# EAGLE design CanRelay (EAGLE 7.7.0)
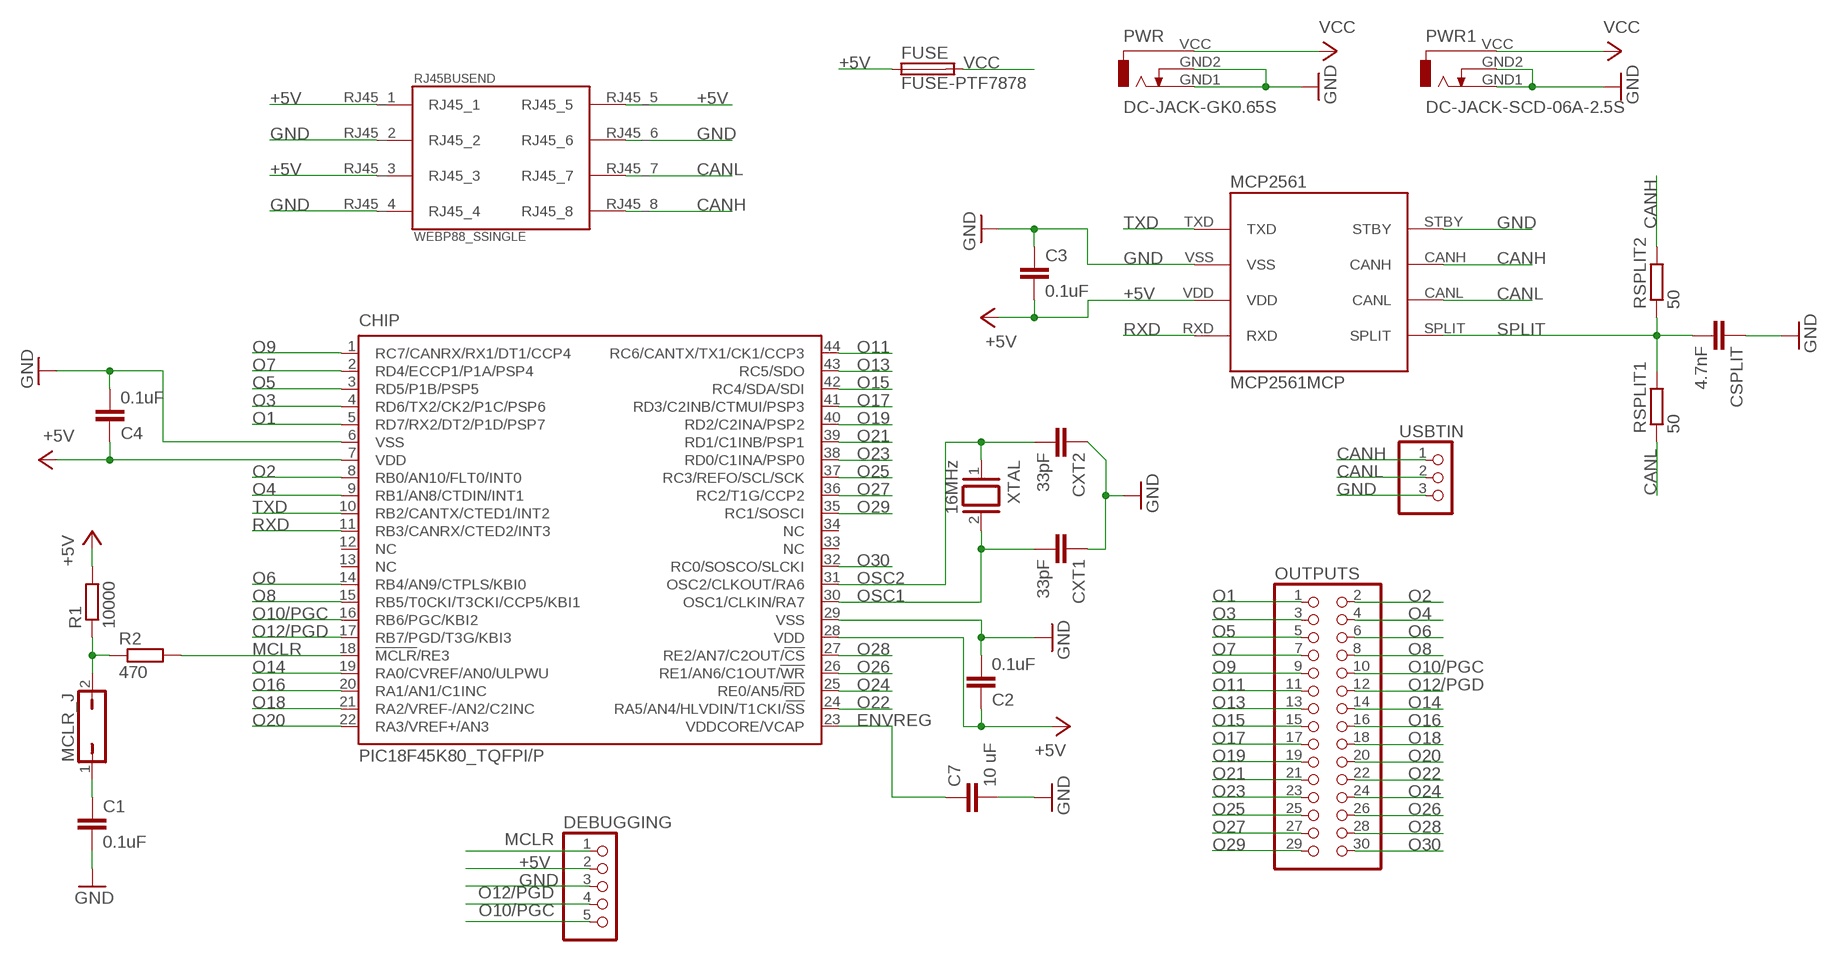
[diagram p0: schematic, sheet 1]

## Parts
C1  0.1uF  C-EU050-025X075  [C050-025X075]
C2  0.1uF  C-EU050-025X075  [C050-025X075]
C3  0.1uF  C-EU050-025X075  [C050-025X075]
C4  0.1uF  C-EU050-025X075  [C050-025X075]
C7  10 uF  C-EU050-025X075  [C050-025X075]
CHIP  PIC18F45K80_TQFPI/P  [TQFP44]
CSPLIT  4.7nF  C-EU050-025X075  [C050-025X075]
CXT1  33pF  C-EU025-030X050  [C025-030X050]
CXT2  33pF  C-EU025-030X050  [C025-030X050]
DEBUGGING  PINHD-1X5  [1X05]
FUSE  FUSE-PTF7878  [FUSE-PTF78]
MCLR_J  JP1Q  [JP1]
MCP2561  MCP2561MCP  [MCP2561_PDIP]
OUTPUTS  PINHD-2X15  [2X15]
PWR  DC-JACK-GK0.65S  [DC-JACK-GK0.65]
PWR1  DC-JACK-SCD-06A-2.5S  [DC-JACK-SCD-016A-2.5]
R1  10000  R-EU_0207/10  [0207/10]
R2  470  R-EU_0207/10  [0207/10]
RJ45BUSEND  WEBP88_SSINGLE  [WEBP88_RJ45_SINGLE]
RSPLIT1  50  R-EU_0207/10  [0207/10]
RSPLIT2  50  R-EU_0207/10  [0207/10]
USBTIN  PINHD-1X3  [1X03]
XTAL  16MHz  XTAL/S  [QS]

## Nets
+5V: C2.1 C3.2 C4.1 CHIP.7(VDD) CHIP.28(VDD) DEBUGGING.2 FUSE.P1 MCP2561.VDD R1.2 RJ45BUSEND.RJ45_1 RJ45BUSEND.RJ45_3 RJ45BUSEND.RJ45_5
CANH: MCP2561.CANH RJ45BUSEND.RJ45_8 RSPLIT2.2 USBTIN.1
CANL: MCP2561.CANL RJ45BUSEND.RJ45_7 RSPLIT1.1 USBTIN.2
ENVREG: C7.1 CHIP.23(VDDCORE/VCAP)
GND: C1.2 C2.2 C3.1 C4.2 C7.2 CHIP.6(VSS) CHIP.29(VSS) CSPLIT.1 CXT1.1 CXT2.1 DEBUGGING.3 MCP2561.STBY MCP2561.VSS PWR1.GND1 PWR1.GND2 PWR.GND1 PWR.GND2 RJ45BUSEND.RJ45_2 RJ45BUSEND.RJ45_4 RJ45BUSEND.RJ45_6 USBTIN.3
MCLR: CHIP.18(!MCLR!/RE3) DEBUGGING.1 R2.2
N$1: C1.1 MCLR_J.1
N$2: MCLR_J.2 R1.1 R2.1
O1: CHIP.5(RD7/RX2/DT2/P1D/PSP7) OUTPUTS.1
O2: CHIP.8(RB0/AN10/FLT0/INT0) OUTPUTS.2
O3: CHIP.4(RD6/TX2/CK2/P1C/PSP6) OUTPUTS.3
O4: CHIP.9(RB1/AN8/CTDIN/INT1) OUTPUTS.4
O5: CHIP.3(RD5/P1B/PSP5) OUTPUTS.5
O6: CHIP.14(RB4/AN9/CTPLS/KBI0) OUTPUTS.6
O7: CHIP.2(RD4/ECCP1/P1A/PSP4) OUTPUTS.7
O8: CHIP.15(RB5/T0CKI/T3CKI/CCP5/KBI1) OUTPUTS.8
O9: CHIP.1(RC7/CANRX/RX1/DT1/CCP4) OUTPUTS.9
O10/PGC: CHIP.16(RB6/PGC/KBI2) DEBUGGING.5 OUTPUTS.10
O11: CHIP.44(RC6/CANTX/TX1/CK1/CCP3) OUTPUTS.11
O12/PGD: CHIP.17(RB7/PGD/T3G/KBI3) DEBUGGING.4 OUTPUTS.12
O13: CHIP.43(RC5/SDO) OUTPUTS.13
O14: CHIP.19(RA0/CVREF/AN0/ULPWU) OUTPUTS.14
O15: CHIP.42(RC4/SDA/SDI) OUTPUTS.15
O16: CHIP.20(RA1/AN1/C1INC) OUTPUTS.16
O17: CHIP.41(RD3/C2INB/CTMUI/PSP3) OUTPUTS.17
O18: CHIP.21(RA2/VREF-/AN2/C2INC) OUTPUTS.18
O19: CHIP.40(RD2/C2INA/PSP2) OUTPUTS.19
O20: CHIP.22(RA3/VREF+/AN3) OUTPUTS.20
O21: CHIP.39(RD1/C1INB/PSP1) OUTPUTS.21
O22: CHIP.24(RA5/AN4/HLVDIN/T1CKI/!SS!) OUTPUTS.22
O23: CHIP.38(RD0/C1INA/PSP0) OUTPUTS.23
O24: CHIP.25(RE0/AN5/!RD!) OUTPUTS.24
O25: CHIP.37(RC3/REFO/SCL/SCK) OUTPUTS.25
O26: CHIP.26(RE1/AN6/C1OUT/!WR!) OUTPUTS.26
O27: CHIP.36(RC2/T1G/CCP2) OUTPUTS.27
O28: CHIP.27(RE2/AN7/C2OUT/!CS!) OUTPUTS.28
O29: CHIP.35(RC1/SOSCI) OUTPUTS.29
O30: CHIP.32(RC0/SOSCO/SLCKI) OUTPUTS.30
OSC1: CHIP.30(OSC1/CLKIN/RA7) CXT1.2 XTAL.2
OSC2: CHIP.31(OSC2/CLKOUT/RA6) CXT2.2 XTAL.1
RXD: CHIP.11(RB3/CANRX/CTED2/INT3) MCP2561.RXD
SPLIT: CSPLIT.2 MCP2561.SPLIT RSPLIT1.2 RSPLIT2.1
TXD: CHIP.10(RB2/CANTX/CTED1/INT2) MCP2561.TXD
VCC: FUSE.P2 PWR1.VCC PWR.VCC
Unconnected: CHIP.12(NC) CHIP.13(NC) CHIP.33(NC) CHIP.34(NC)

## Library data of the parts
C1-C4 C7 CSPLIT CXT1 CXT2 = rcl:C-EU: CAPACITOR, European symbol
CHIP = PoJD:PIC18F45K80_TQFP: PIC18F4*K80. TQFP44 variant.
DEBUGGING = pinhead:PINHD-1X5: PIN HEADER
FUSE = PoJD:FUSE-PTF78: Pojistkové pouzdro do DPS pro pojistky 5x20mm. Otevírání pomocí šroubováku. Nastojato. Rozteč vývodů: 22,6mm Jmenovité napětí: 250V AC Jmenovitý proud: 6,3A Součástí dodávky je kryt. https://www.gme.cz/pojistkove-pouzdro-do-dps-ks-ptf78-bs232
MCLR_J = jumper:JP1Q: JUMPER
MCP2561 = PoJD:MCP2561: High-Speed CAN Transceiver See http://ww1.microchip.com/downloads/en/DeviceDoc/25167A.pdf The MCP2561/2 is a Microchip Technology Inc. second generation high-speed CAN transceiver. It serves as an interface between a CAN protocol controller and the physical two-wire CAN bus. The device meets the automotive requirements for high-speed (up to 1 Mb/s), low quiescent current, electromagnetic compatibility (EMC) and electrostatic discharge (ESD).
OUTPUTS = pinhead:PINHD-2X15: PIN HEADER
PWR = PoJD:DC-JACK-GK0.65: Napájecí souosý konektor PC-GK0.65. https://www.gme.cz/napajeci-souosy-konektor-pc-gk0-65
PWR1 = PoJD:DC-JACK-SCD-06A-2.5: Napájecí souosý konektor do DPS 2,5mm vidlice. https://www.gme.cz/napajeci-souosy-konektor-scd-016a.
R1 R2 RSPLIT1 RSPLIT2 = rcl:R-EU_: RESISTOR, European symbol
RJ45BUSEND = PoJD:WEBP88_S: RJ45 konektor do DPS, 8/8 pinů. https://www.gme.cz/rj-konektor-webp-8-8-pcb
USBTIN = pinhead:PINHD-1X3: PIN HEADER
XTAL = special:XTAL/S: CRYSTAL

## Board
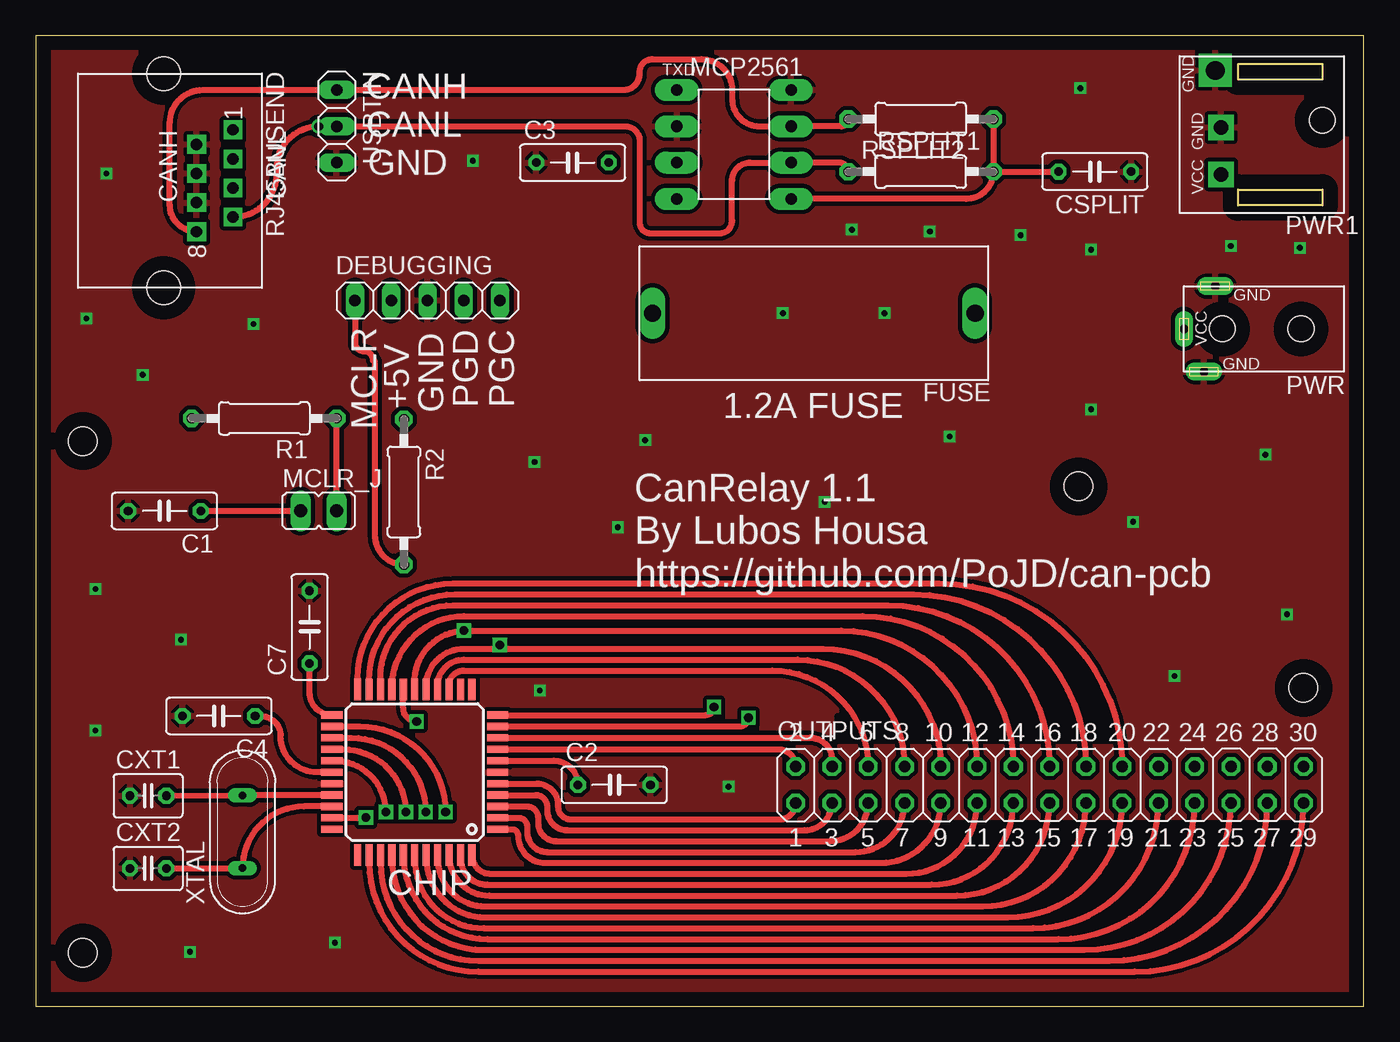
[diagram p1: board, top side]
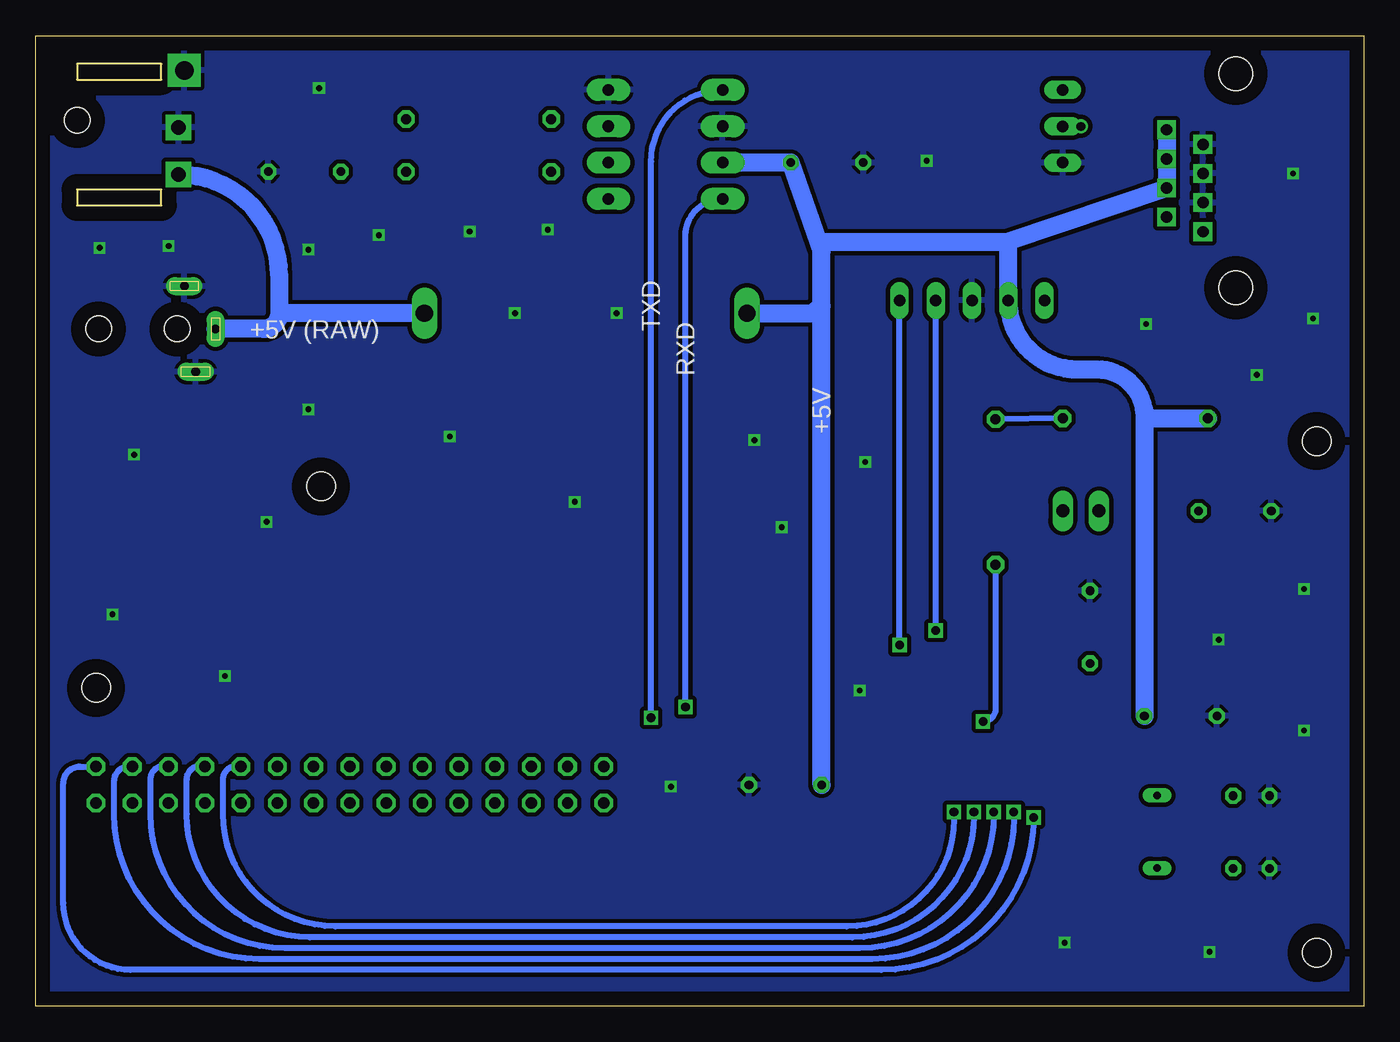
[diagram p2: board, bottom side, seen from below]

Size 93 x 67.94 mm. Coordinates in mm from the lower left corner, seen from the top.
Outline: 0,0 93,0 93,67.94 0,67.94 0,0
Copper layers (1*16): Top 0.035mm / dielectric 1.5mm / Bottom 0.035mm
Design rules "default *": minimum track width 0.015240625mm, minimum drill 0.3mm, track to track 8mil, track to pad 8mil, pad to pad 8mil, via to via 8mil, smd to smd 8mil, copper to edge 40mil, drill to drill 8mil, minimum pad ring 10mil, minimum via ring 8mil, stop-mask expansion 8mil, vias tented up to drill 0.6mm, thermal gap 10mil
Holes 2 mm at 3.3,39.56 88.77,22.28 3.3,3.74 73.03,36.38

### Footprints (pad centres in the part's own frame; a part is rotated, then mirrored left to right if it is on the bottom)
C050-025X075 = drill 0.6 octagon: 1 -2.54,0; 2 2.54,0
TQFP44 = smd 1.5 x 0.5: 1 -5.8,4; 2 -5.8,3.2; 3 -5.8,2.4; 4 -5.8,1.6; 5 -5.8,0.8; 6 -5.8,0; 7 -5.8,-0.8; 8 -5.8,-1.6; 9 -5.8,-2.4; 10 -5.8,-3.2; 11 -5.8,-4; 23 5.8,-4; 24 5.8,-3.2; 25 5.8,-2.4; 26 5.8,-1.6; 27 5.8,-0.8; 28 5.8,0; 29 5.8,0.8; 30 5.8,1.6; 31 5.8,2.4; 32 5.8,3.2; 33 5.8,4 | smd 0.5 x 1.5: 12 -4,-5.8; 13 -3.2,-5.8; 14 -2.4,-5.8; 15 -1.6,-5.8; 16 -0.8,-5.8; 17 0,-5.8; 18 0.8,-5.8; 19 1.6,-5.8; 20 2.4,-5.8; 21 3.2,-5.8; 22 4,-5.8; 34 4,5.8; 35 3.2,5.8; 36 2.4,5.8; 37 1.6,5.8; 38 0.8,5.8; 39 0,5.8; 40 -0.8,5.8; 41 -1.6,5.8; 42 -2.4,5.8; 43 -3.2,5.8; 44 -4,5.8
C025-030X050 = drill 0.6 octagon: 1 -1.27,0; 2 1.27,0
1X05 = drill 0.8 long: 1 -5.08,0; 2 -2.54,0; 3 0,0; 4 2.54,0; 5 5.08,0
FUSE-PTF78 = drill 1.2 long: P1 11.3,0; P2 -11.3,0
JP1 = drill 0.914 long: 1 0,-1.27; 2 0,1.27
MCP2561_PDIP = drill 0.813 pad 1.524 long: CANH 4,1.27; CANL 4,-1.27; RXD -4,-3.81; SPLIT 4,-3.81; STBY 4,3.81; TXD -4,3.81; VDD -4,-1.27; VSS -4,1.27
2X15 = drill 0.8 octagon: 1 -17.78,-1.27; 2 -17.78,1.27; 3 -15.24,-1.27; 4 -15.24,1.27; 5 -12.7,-1.27; 6 -12.7,1.27; 7 -10.16,-1.27; 8 -10.16,1.27; 9 -7.62,-1.27; 10 -7.62,1.27; 11 -5.08,-1.27; 12 -5.08,1.27; 13 -2.54,-1.27; 14 -2.54,1.27; 15 0,-1.27; 16 0,1.27; 17 2.54,-1.27; 18 2.54,1.27; 19 5.08,-1.27; 20 5.08,1.27; 21 7.62,-1.27; 22 7.62,1.27; 23 10.16,-1.27; 24 10.16,1.27; 25 12.7,-1.27; 26 12.7,1.27; 27 15.24,-1.27; 28 15.24,1.27; 29 17.78,-1.27; 30 17.78,1.27
DC-JACK-GK0.65 = drill 0.6 pad 1.27 long: GND1 4.2,3; GND2 3.4,-3; VCC 5.6,0 | hole 1.8: -2.6,0; 2.9,0
DC-JACK-SCD-016A-2.5 = drill 1 pad 1.8 square: GND1 2.85,-0.5; VCC 2.85,2.8 | drill 1.3 pad 2.3 square: GND2 3.25,-4.5 | hole 1.8: -4.25,-1
0207/10 = drill 0.7 octagon: 1 -5.08,0; 2 5.08,0
WEBP88_RJ45_SINGLE = drill 0.8 square: RJ45_1 -3.57,4.41; RJ45_2 -2.55,1.87; RJ45_3 -1.53,4.41; RJ45_4 -0.51,1.87; RJ45_5 0.51,4.41; RJ45_6 1.53,1.87; RJ45_7 2.55,4.41; RJ45_8 3.57,1.87 | hole 2.36: -7.5,-0.43; 7.5,-0.43
1X03 = drill 0.8 long: 1 -2.54,0; 2 0,0; 3 2.54,0
QS = drill 0.5 long: 1 -2.54,0; 2 2.54,0

### Placement (x,y rotation side)
C1  9.02,34.67 180 top
C2  40.51,15.5 0 top
C3  37.59,59.05 0 top
C4  12.83,20.32 180 top
C7  19.18,26.54 90 top
CHIP  26.54,16.38 180 top
CSPLIT  74.17,58.42 180 top
CXT1  7.87,14.73 0 top
CXT2  7.87,9.65 0 top
DEBUGGING  27.43,49.4 0 top
FUSE  54.48,48.51 180 top
MCLR_J  19.81,34.67 270 top
MCP2561  48.9,60.33 0 top
OUTPUTS  71,15.5 0 top
PWR  86,47.41 180 top
PWR1  85.85,61.01 180 top
R1  16,41.15 180 top
R2  25.78,36 270 top
RJ45BUSEND  9.4,57.78 270 top
RSPLIT1  61.98,58.42 0 top
RSPLIT2  61.98,62.1 180 top
USBTIN  21.08,61.59 270 top
XTAL  14.48,12.21 90 top

### Tracks (layer width: path | path; a pad name or v marks a point on that pad's centre or on a via)
+5V
  Top 0.406: CHIP.28 19.68,16.38 arc-90 17.14,18.92 arc90 15.75,20.32 C4.1 | CHIP.7 36.29,17.18 arc-90 C2.1
  Bottom 1.27: RJ45BUSEND.RJ45_1 RJ45BUSEND.RJ45_3 RJ45BUSEND.RJ45_5 25.02,53.47 | MCP2561.VDD C3.2 37.97,52.83 | 25.02,53.47 arc90 24.89,53.34 DEBUGGING.2 arc-90 20.07,44.58 18.67,44.58 arc90 15.37,41.27 | 25.02,53.47 37.97,53.47 37.97,52.83 | C2.1 37.97,49.02 | 37.97,49.02 37.97,52.83 | FUSE.P1 38.61,48.51 37.97,49.02 | 15.37,41.27 C4.1 | 15.37,41.27 arc-90 15.24,41.15 R1.2
CANH
  Top 0.406: RSPLIT2.2 arc-90 56.39,61.59 MCP2561.CANH 50.67,61.59 arc-90 48.77,63.5 48.77,64.14 arc90 46.61,66.29 43.18,66.29 arc90 42.29,65.41 42.29,65.28 arc-90 41.15,64.14 USBTIN.1 11.68,64.14 arc90 9.4,61.85 9.4,56.09 arc90 RJ45BUSEND.RJ45_8
CANL  (via drill 0.6)
  Top 0.406: RSPLIT1.1 arc90 56.26,59.05 MCP2561.CANL 50.04,59.05 arc90 48.77,57.78 48.77,54.99 arc-90 47.88,54.1 43.05,54.1 arc-90 42.29,54.86 42.29,60.58 arc90 41.27,61.59 USBTIN.2 | RJ45BUSEND.RJ45_7 arc90 16.89,58.32 16.89,58.67 arc-90 v19.81,61.59
  Bottom 0.406: v19.81,61.59 USBTIN.2
ENVREG
  Top 0.406: CHIP.23 arc-90 19.18,21.95 C7.1
GND  (via drill 0.4)
  other vias: 62.61,54.23 57.15,54.36 3.56,48.13 30.61,59.18 68.96,53.98 73.91,52.96 83.69,53.21 88.52,53.09 4.95,58.29 15.24,47.75 7.49,44.2 4.19,29.21 10.16,25.65 10.79,3.81 4.19,19.3 20.95,4.45 79.76,23.11 87.63,27.43 76.83,33.91 86.11,38.61 73.91,41.78 64.01,39.88 55.24,35.31 42.67,39.62 40.77,33.53 34.92,38.1 59.44,48.51 52.32,48.51 73.15,64.26 48.51,15.37 35.31,22.1
  pour Top (isolate 0.3): 0.76,67.31 92.5,67.31 92.5,0.7 0.76,0.7
  pour Bottom (isolate 0.3): 0.76,67.31 92.5,67.31 92.5,0.7 0.76,0.7
MCLR  (via drill 0.6)
  Top 0.406: DEBUGGING.1 22.35,46.48 arc90 22.99,45.85 arc-90 23.62,45.21 arc-90 23.75,45.09 23.75,32.95 arc90 R2.2 | v26.67,19.94 arc-90 25.74,20.87 CHIP.18
  Bottom 0.406: R2.2 25.78,20.83 arc90 v26.67,19.94
N$1
  Top 0.406: C1.1 MCLR_J.1
N$2
  Top 0.406: MCLR_J.2 R1.1
  Bottom 0.406: R1.1 R2.1
N$3
  cutout Top: 56.13,20.32 75.69,20.32 75.69,20.45 75.69,18.54 56.13,18.54
O1
  Top 0.406: CHIP.5 35.09,15.58 arc-90 36.58,14.1 36.58,13.97 arc90 37.47,13.08 52.07,13.08 arc90 OUTPUTS.1
O2
  Top 0.406: CHIP.8 52.01,17.98 arc-90 OUTPUTS.2
O3
  Top 0.406: CHIP.4 35,14.78 arc-90 35.81,13.97 35.81,13.72 arc90 37.21,12.32 53.85,12.32 arc90 OUTPUTS.3
O4
  Top 0.406: CHIP.9 arc-90 32.36,18.8 54.24,18.8 arc-90 55.76,17.27 OUTPUTS.4
O5
  Top 0.406: CHIP.3 34.4,13.98 arc-90 35.18,13.21 35.18,12.83 arc90 36.45,11.56 55.63,11.56 arc90 OUTPUTS.5
O6
  Top 0.406: CHIP.14 28.94,22.47 arc-90 29.97,23.5 51.58,23.5 arc-90 OUTPUTS.6
O7
  Top 0.406: CHIP.2 33.81,13.18 arc-90 34.42,12.57 34.42,12.19 arc90 35.81,10.79 57.41,10.79 arc90 OUTPUTS.7
O8
  Top 0.406: CHIP.15 28.14,22.43 arc-90 29.97,24.26 53.35,24.26 arc-90 OUTPUTS.8
O9
  Top 0.406: CHIP.1 33.34,12.38 arc-90 33.78,11.94 arc90 35.69,10.03 59.18,10.03 arc90 OUTPUTS.9
O10/PGC  (via drill 0.6)
  Top 0.406: CHIP.16 27.34,22.39 arc-90 29.97,25.02 32.51,25.02 | 32.51,25.02 55.13,25.02 arc-90 OUTPUTS.10 | 32.51,25.02 v32.51,25.27
  Bottom 0.406: v32.51,25.27 DEBUGGING.5
O11
  Top 0.406: CHIP.44 arc90 31.86,9.27 60.96,9.27 arc90 OUTPUTS.11
O12/PGD  (via drill 0.6)
  Top 0.406: CHIP.17 26.54,22.61 arc-90 v29.97,26.29 56.4,26.29 arc-90 OUTPUTS.12
  Bottom 0.406: v29.97,26.29 DEBUGGING.4
O13
  Top 0.406: CHIP.43 29.74,10.39 arc90 31.62,8.51 62.74,8.51 arc90 OUTPUTS.13
O14
  Top 0.406: CHIP.19 24.94,22.28 arc-90 29.97,27.3 57.92,27.3 arc-90 OUTPUTS.14
O15
  Top 0.406: CHIP.42 28.94,10.55 arc90 31.75,7.75 64.52,7.75 arc90 OUTPUTS.15
O16
  Top 0.406: CHIP.20 24.14,23 arc-90 29.21,28.07 59.7,28.07 arc-90 OUTPUTS.16
O17
  Top 0.406: CHIP.41 28.14,10.34 arc90 31.5,6.99 66.3,6.99 arc90 OUTPUTS.17
O18
  Top 0.406: CHIP.21 23.34,22.84 arc-90 29.34,28.83 61.48,28.83 arc-90 OUTPUTS.18
O19
  Top 0.406: CHIP.40 27.34,10.38 arc90 31.5,6.22 68.07,6.22 arc90 OUTPUTS.19
O20
  Top 0.406: CHIP.22 22.54,22.92 arc-90 29.21,29.59 63.26,29.59 arc-90 OUTPUTS.20
O21
  Top 0.406: CHIP.39 26.54,10.29 arc90 31.37,5.46 69.85,5.46 arc90 OUTPUTS.21
O22  (via drill 0.6)
  Top 0.406: CHIP.24 22.71,19.58 arc-90 v28.7,13.59
  Bottom 0.406: v28.7,13.59 28.7,13.08 arc90 36.2,5.59 72.01,5.59 arc90 79.88,13.46 79.88,15.88 arc109 OUTPUTS.22
O23
  Top 0.406: CHIP.38 CHIP.38 arc90 31.62,4.7 71.63,4.7 arc90 OUTPUTS.23
O24  (via drill 0.6)
  Top 0.406: CHIP.25 22.11,18.78 arc-90 v27.3,13.59
  Bottom 0.406: v27.3,13.59 27.3,13.34 arc90 35.81,4.83 73.79,4.83 arc90 82.42,13.46 82.42,15.88 arc109 OUTPUTS.24
O25
  Top 0.406: CHIP.37 24.94,10.36 arc90 31.37,3.94 73.41,3.94 arc90 OUTPUTS.25
O26  (via drill 0.6)
  Top 0.406: CHIP.26 21.51,17.98 arc-90 v25.91,13.59
  Bottom 0.406: v25.91,13.59 25.91,13.46 arc90 35.31,4.06 75.56,4.06 arc90 84.96,13.46 84.96,15.88 arc109 OUTPUTS.26
O27
  Top 0.406: CHIP.36 24.14,10.02 arc90 30.99,3.17 75.19,3.17 arc90 OUTPUTS.27
O28  (via drill 0.6)
  Top 0.406: CHIP.27 20.92,17.18 arc-90 v24.51,13.59
  Bottom 0.406: v24.51,13.59 24.51,13.21 arc90 34.42,3.3 77.34,3.3 arc90 87.5,13.46 87.5,15.75 arc102 OUTPUTS.28
O29
  Top 0.406: CHIP.35 23.34,10.06 arc90 30.99,2.41 76.96,2.41 arc90 OUTPUTS.29
O30  (via drill 0.6)
  Top 0.406: CHIP.32 v23.11,13.21
  Bottom 0.406: v23.11,13.21 arc90 33.78,2.54 86.36,2.54 arc90 91.06,7.24 91.06,15.62 arc90 89.91,16.77 OUTPUTS.30
OSC1
  Top 0.406: CHIP.30 XTAL.2 CXT1.2
OSC2
  Top 0.406: CHIP.31 18.79,13.98 arc90 XTAL.1 CXT2.2
RXD  (via drill 0.6)
  Top 0.406: CHIP.11 46.93,20.38 arc90 v47.5,20.95
  Bottom 0.406: v47.5,20.95 47.5,53.91 arc90 MCP2561.RXD
SKIP2
  cutout Top: 55.37,12.83 88.52,12.83 88.52,11.3 55.37,11.3
SPLIT
  Top 0.406: 67.31,62.1 RSPLIT2.1 RSPLIT1.2 | RSPLIT1.2 CSPLIT.2 | RSPLIT1.2 arc-90 65.15,56.52 MCP2561.SPLIT
TXD  (via drill 0.6)
  Top 0.406: CHIP.10 49.3,19.58 arc90 v49.91,20.19
  Bottom 0.406: v49.91,20.19 49.91,59.12 arc90 MCP2561.TXD
VCC
  Bottom 1.27: FUSE.P2 75.95,48.51 | 75.95,48.51 arc90 77.05,47.41 PWR.VCC | 75.95,48.51 75.95,51.16 arc-90 PWR1.VCC

### Text on the board
tPlace: CANH | CANL | GND | CANL | CANH | +5V | GND | PGD | PGC | 1.2A FUSE | MCLR | CanRelay 1.1 / By Lubos Housa / https://github.com/PoJD/can-pcb | 2 | 4 | 6 | 8 | 10 | 12 | 14 | 16 | 18 | 20 | 22 | 24 | 26 | 28 | 30 | 1 | 3 | 5 | 7 | 9 | 11 | 13 | 15 | 17 | 19 | 21 | 23 | 25 | 27 | 29
bPlace: TXD | RXD | +5V (RAW) | +5V